# EAGLE schematic flushfpga (EAGLE 8.5.0)
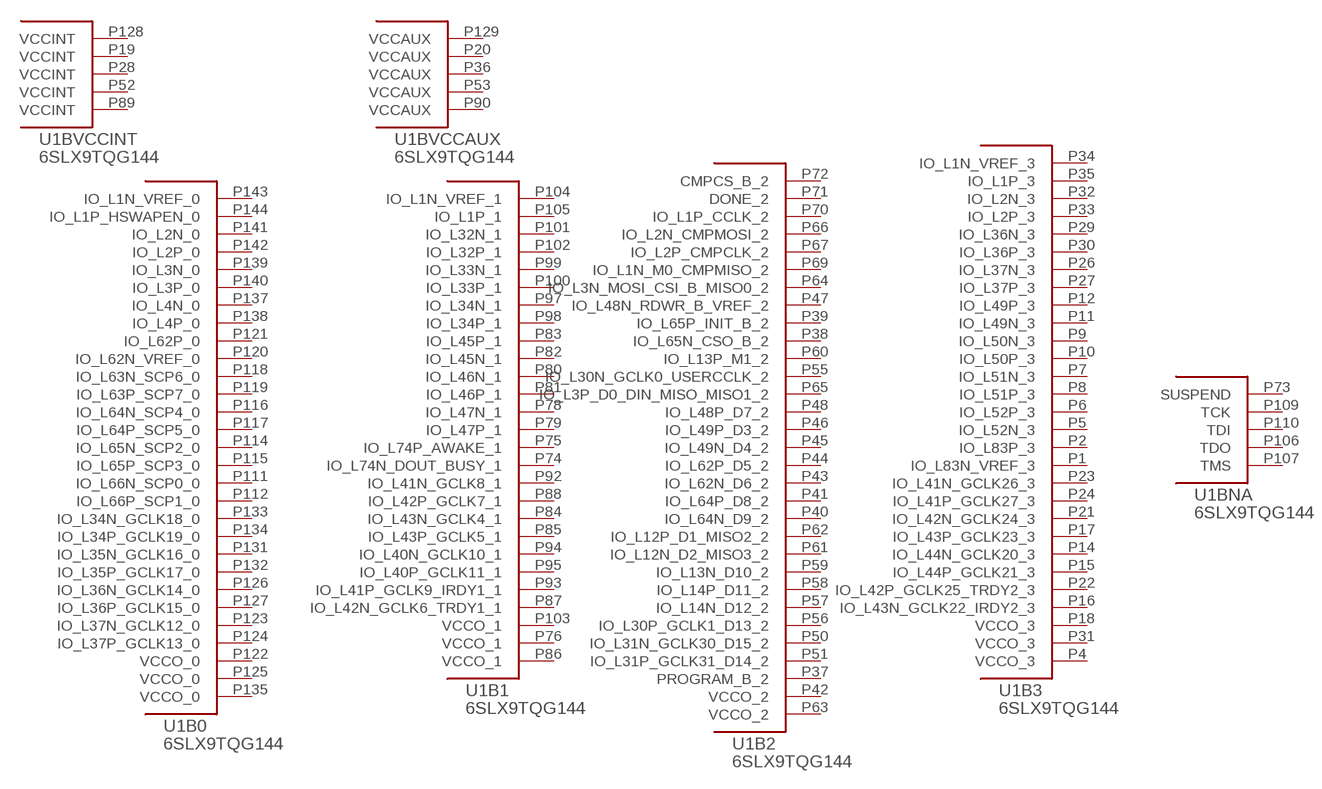
[diagram p0: schematic, sheet 1]

## Parts
U1  6SLX9TQG144  [TQ144]
Unconnected: U1.P1(B3:IO_L83N_VREF_3) U1.P2(B3:IO_L83P_3) U1.P4(B3:VCCO_3) U1.P5(B3:IO_L52N_3) U1.P6(B3:IO_L52P_3) U1.P7(B3:IO_L51N_3) U1.P8(B3:IO_L51P_3) U1.P9(B3:IO_L50N_3) U1.P10(B3:IO_L50P_3) U1.P11(B3:IO_L49N_3) U1.P12(B3:IO_L49P_3) U1.P14(B3:IO_L44N_GCLK20_3) U1.P15(B3:IO_L44P_GCLK21_3) U1.P16(B3:IO_L43N_GCLK22_IRDY2_3) U1.P17(B3:IO_L43P_GCLK23_3) U1.P18(B3:VCCO_3) U1.P19(BVCCINT:VCCINT) U1.P20(BVCCAUX:VCCAUX) U1.P21(B3:IO_L42N_GCLK24_3) U1.P22(B3:IO_L42P_GCLK25_TRDY2_3) U1.P23(B3:IO_L41N_GCLK26_3) U1.P24(B3:IO_L41P_GCLK27_3) U1.P26(B3:IO_L37N_3) U1.P27(B3:IO_L37P_3) U1.P28(BVCCINT:VCCINT) U1.P29(B3:IO_L36N_3) U1.P30(B3:IO_L36P_3) U1.P31(B3:VCCO_3) U1.P32(B3:IO_L2N_3) U1.P33(B3:IO_L2P_3) U1.P34(B3:IO_L1N_VREF_3) U1.P35(B3:IO_L1P_3) U1.P36(BVCCAUX:VCCAUX) U1.P37(B2:PROGRAM_B_2) U1.P38(B2:IO_L65N_CSO_B_2) U1.P39(B2:IO_L65P_INIT_B_2) U1.P40(B2:IO_L64N_D9_2) U1.P41(B2:IO_L64P_D8_2) U1.P42(B2:VCCO_2) U1.P43(B2:IO_L62N_D6_2) U1.P44(B2:IO_L62P_D5_2) U1.P45(B2:IO_L49N_D4_2) U1.P46(B2:IO_L49P_D3_2) U1.P47(B2:IO_L48N_RDWR_B_VREF_2) U1.P48(B2:IO_L48P_D7_2) U1.P50(B2:IO_L31N_GCLK30_D15_2) U1.P51(B2:IO_L31P_GCLK31_D14_2) U1.P52(BVCCINT:VCCINT) U1.P53(BVCCAUX:VCCAUX) U1.P55(B2:IO_L30N_GCLK0_USERCCLK_2) U1.P56(B2:IO_L30P_GCLK1_D13_2) U1.P57(B2:IO_L14N_D12_2) U1.P58(B2:IO_L14P_D11_2) U1.P59(B2:IO_L13N_D10_2) U1.P60(B2:IO_L13P_M1_2) U1.P61(B2:IO_L12N_D2_MISO3_2) U1.P62(B2:IO_L12P_D1_MISO2_2) U1.P63(B2:VCCO_2) U1.P64(B2:IO_L3N_MOSI_CSI_B_MISO0_2) U1.P65(B2:IO_L3P_D0_DIN_MISO_MISO1_2) U1.P66(B2:IO_L2N_CMPMOSI_2) U1.P67(B2:IO_L2P_CMPCLK_2) U1.P69(B2:IO_L1N_M0_CMPMISO_2) U1.P70(B2:IO_L1P_CCLK_2) U1.P71(B2:DONE_2) U1.P72(B2:CMPCS_B_2) U1.P73(BNA:SUSPEND) U1.P74(B1:IO_L74N_DOUT_BUSY_1) U1.P75(B1:IO_L74P_AWAKE_1) U1.P76(B1:VCCO_1) U1.P78(B1:IO_L47N_1) U1.P79(B1:IO_L47P_1) U1.P80(B1:IO_L46N_1) U1.P81(B1:IO_L46P_1) U1.P82(B1:IO_L45N_1) U1.P83(B1:IO_L45P_1) U1.P84(B1:IO_L43N_GCLK4_1) U1.P85(B1:IO_L43P_GCLK5_1) U1.P86(B1:VCCO_1) U1.P87(B1:IO_L42N_GCLK6_TRDY1_1) U1.P88(B1:IO_L42P_GCLK7_1) U1.P89(BVCCINT:VCCINT) U1.P90(BVCCAUX:VCCAUX) U1.P92(B1:IO_L41N_GCLK8_1) U1.P93(B1:IO_L41P_GCLK9_IRDY1_1) U1.P94(B1:IO_L40N_GCLK10_1) U1.P95(B1:IO_L40P_GCLK11_1) U1.P97(B1:IO_L34N_1) U1.P98(B1:IO_L34P_1) U1.P99(B1:IO_L33N_1) U1.P100(B1:IO_L33P_1) U1.P101(B1:IO_L32N_1) U1.P102(B1:IO_L32P_1) U1.P103(B1:VCCO_1) U1.P104(B1:IO_L1N_VREF_1) U1.P105(B1:IO_L1P_1) U1.P106(BNA:TDO) U1.P107(BNA:TMS) U1.P109(BNA:TCK) U1.P110(BNA:TDI) U1.P111(B0:IO_L66N_SCP0_0) U1.P112(B0:IO_L66P_SCP1_0) U1.P114(B0:IO_L65N_SCP2_0) U1.P115(B0:IO_L65P_SCP3_0) U1.P116(B0:IO_L64N_SCP4_0) U1.P117(B0:IO_L64P_SCP5_0) U1.P118(B0:IO_L63N_SCP6_0) U1.P119(B0:IO_L63P_SCP7_0) U1.P120(B0:IO_L62N_VREF_0) U1.P121(B0:IO_L62P_0) U1.P122(B0:VCCO_0) U1.P123(B0:IO_L37N_GCLK12_0) U1.P124(B0:IO_L37P_GCLK13_0) U1.P125(B0:VCCO_0) U1.P126(B0:IO_L36N_GCLK14_0) U1.P127(B0:IO_L36P_GCLK15_0) U1.P128(BVCCINT:VCCINT) U1.P129(BVCCAUX:VCCAUX) U1.P131(B0:IO_L35N_GCLK16_0) U1.P132(B0:IO_L35P_GCLK17_0) U1.P133(B0:IO_L34N_GCLK18_0) U1.P134(B0:IO_L34P_GCLK19_0) U1.P135(B0:VCCO_0) U1.P137(B0:IO_L4N_0) U1.P138(B0:IO_L4P_0) U1.P139(B0:IO_L3N_0) U1.P140(B0:IO_L3P_0) U1.P141(B0:IO_L2N_0) U1.P142(B0:IO_L2P_0) U1.P143(B0:IO_L1N_VREF_0) U1.P144(B0:IO_L1P_HSWAPEN_0)

## Power pins joined to a net without a drawn wire
GND: U1.P3(BGND:GND) U1.P13(BGND:GND) U1.P25(BGND:GND) U1.P49(BGND:GND) U1.P54(BGND:GND) U1.P68(BGND:GND) U1.P77(BGND:GND) U1.P91(BGND:GND) U1.P96(BGND:GND) U1.P108(BGND:GND) U1.P113(BGND:GND) U1.P130(BGND:GND) U1.P136(BGND:GND)

## Library data of the parts
U1 = xilinx_devices:6SLX9TQG144: Xilinx FPGA: 6slx9tqg144